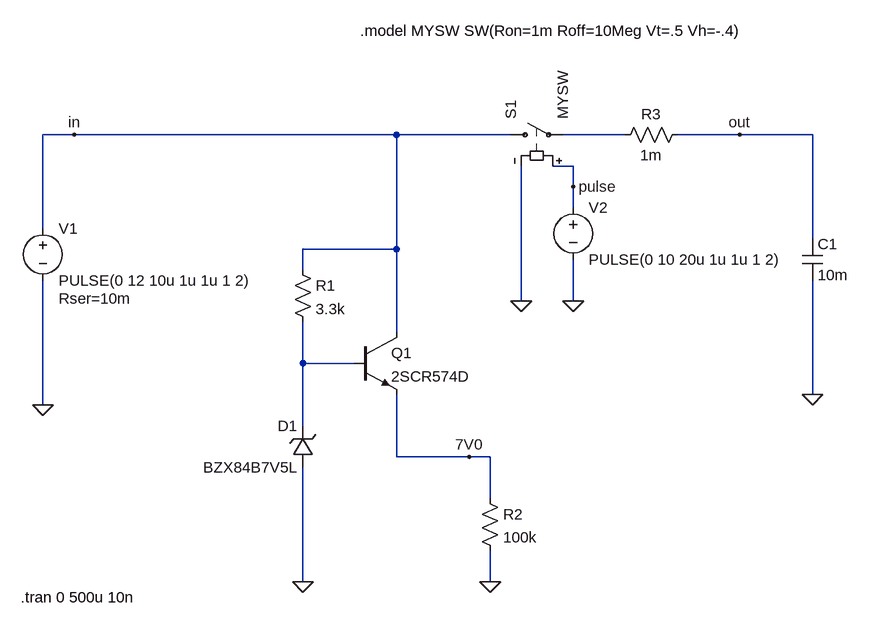
[diagram p0: schematic Draft2.asc]
Draft2.asc, the LTspice schematic file:
Version 4
SHEET 1 1336 744
WIRE 128 16 80 16
WIRE 624 16 128 16
WIRE 800 16 624 16
WIRE 976 16 880 16
WIRE 1152 16 1056 16
WIRE 1264 16 1152 16
WIRE 896 64 864 64
WIRE 896 96 896 64
WIRE 896 128 896 96
WIRE 80 160 80 16
WIRE 1264 176 1264 16
WIRE 624 192 624 16
WIRE 624 192 480 192
WIRE 480 224 480 192
WIRE 816 272 816 64
WIRE 896 272 896 208
WIRE 624 320 624 192
WIRE 480 368 480 304
WIRE 560 368 480 368
WIRE 1264 416 1264 240
WIRE 80 432 80 240
WIRE 480 464 480 368
WIRE 624 512 624 416
WIRE 736 512 624 512
WIRE 768 512 736 512
WIRE 768 576 768 512
WIRE 480 704 480 528
WIRE 768 704 768 656
FLAG 80 432 0
FLAG 768 704 0
FLAG 736 512 7V0
FLAG 480 704 0
FLAG 128 16 in
FLAG 816 272 0
FLAG 896 272 0
FLAG 1264 416 0
FLAG 1152 16 out
FLAG 896 96 pulse
SYMBOL voltage 80 144 R0
WINDOW 123 0 0 Left 0
WINDOW 39 24 124 Left 2
SYMATTR InstName V1
SYMATTR Value PULSE(0 12 10u 1u 1u 1 2)
SYMATTR SpiceLine Rser=10m
SYMBOL npn 560 320 R0
SYMATTR InstName Q1
SYMATTR Value 2SCR574D
SYMBOL res 464 208 R0
SYMATTR InstName R1
SYMATTR Value 3.3k
SYMBOL zener 496 528 R180
WINDOW 0 24 64 Left 2
WINDOW 3 24 0 Left 2
SYMATTR InstName D1
SYMATTR Value BZX84B7V5L
SYMATTR Description Diode
SYMATTR Type diode
SYMBOL res 752 560 R0
SYMATTR InstName R2
SYMATTR Value 100k
SYMBOL sw 784 16 R270
SYMATTR InstName S1
SYMATTR Value MYSW
SYMBOL voltage 896 112 R0
WINDOW 123 0 0 Left 0
WINDOW 39 0 0 Left 0
SYMATTR InstName V2
SYMATTR Value PULSE(0 10 20u 1u 1u 1 2)
SYMBOL cap 1248 176 R0
SYMATTR InstName C1
SYMATTR Value 10m
SYMBOL res 1072 0 R90
WINDOW 0 0 56 VBottom 2
WINDOW 3 32 56 VTop 2
SYMATTR InstName R3
SYMATTR Value 1m
TEXT 568 -144 Left 2 !.model MYSW SW(Ron=1m Roff=10Meg Vt=.5 Vh=-.4)
TEXT 46 728 Left 2 !.tran 0 500u 10n

The netlist it stands for:
* Draft2.asc
V1 in 0 PULSE(0 12 10u 1u 1u 1 2) Rser=10m
Q1 in N002 7V0 0 2SCR574D
R1 in N002 3.3k
D1 0 N002 BZX84B7V5L
R2 7V0 0 100k
S1 in N001 pulse 0 MYSW
V2 pulse 0 PULSE(0 10 20u 1u 1u 1 2)
C1 out 0 10m
R3 out N001 1m
.model D D
.lib standard.dio
.model NPN NPN
.model PNP PNP
.lib standard.bjt
.model MYSW SW(Ron=1m Roff=10Meg Vt=.5 Vh=-.4)
.tran 0 500u 10n
.backanno
.end